# EAGLE design board (EAGLE 8.6.0)
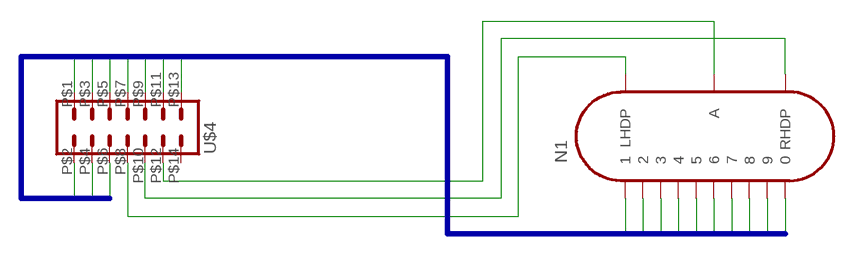
[diagram p0: schematic, sheet 1]

## Parts
N1  IN-14  [IN-14]
U$4  PIN_HEADER_MALE_2X07_14P  [PIN_HEADER_MALE_2X07_14P]

## Nets
N$1: N1.A U$4.P$12
N$2: N1.LHDP U$4.P$8
N$3: N1.RHDP U$4.P$10
NIXIE0: N1.0 U$4.P$1
NIXIE1: N1.1 U$4.P$3
NIXIE2: N1.2 U$4.P$5
NIXIE3: N1.3 U$4.P$7
NIXIE4: N1.4 U$4.P$9
NIXIE5: N1.5 U$4.P$11
NIXIE6: N1.6 U$4.P$13
NIXIE7: N1.7 U$4.P$2
NIXIE8: N1.8 U$4.P$4
NIXIE9: N1.9 U$4.P$6
Unconnected: U$4.P$14

## Buses
NIXIE[0..9]

## Library data of the parts
N1 = russian-nixies:IN-14: IN-14: medium numeric frontview nixie tube
U$4 = 160713 Library by matsu:PIN_HEADER_MALE_2X07_14P

## Net classes
0 default: width 0.508 mm, clearance 0.254 mm

## Board
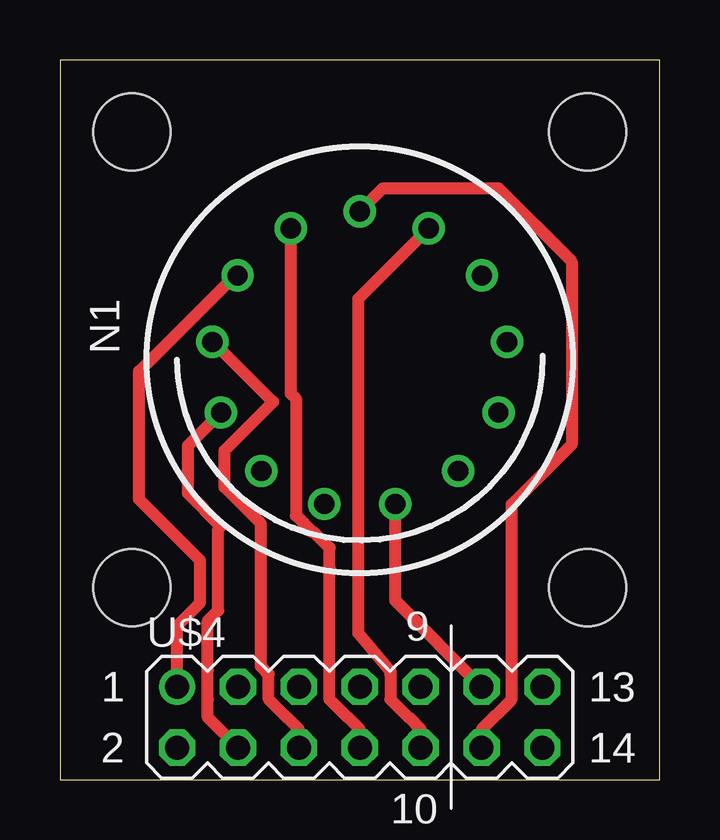
[diagram p1: board, top side]
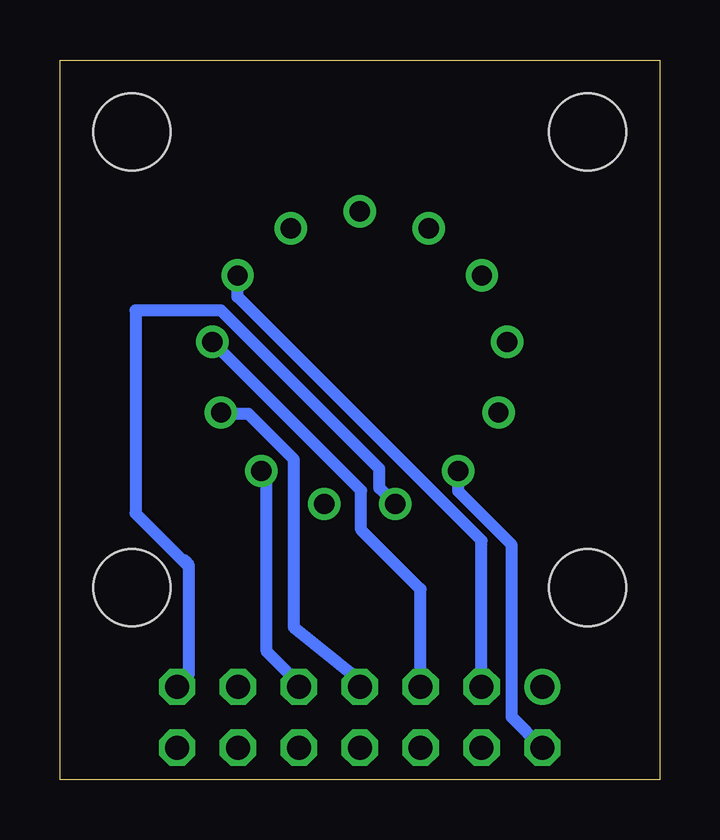
[diagram p2: board, bottom side, seen from below]

Size 25 x 30 mm. Coordinates in mm from the lower left corner, seen from the top.
Outline: 0,0 25,0 25,30 0,30 0,0
Copper layers (1*16): Top 0.035mm / dielectric 1.5mm / Bottom 0.035mm
Design rules "Elecrow_2-layer_eagle_rule": minimum track width 6mil, minimum drill 12mil, track to track 6mil, track to pad 6mil, pad to pad 6mil, via to via 6mil, smd to smd 0mil, copper to edge 10mil, drill to drill 10mil, minimum pad ring 10mil, minimum via ring 6mil, stop-mask expansion 2mil, vias tented up to drill 100mil, thermal gap 10mil
Holes 3.2 mm at 3,27 22,27 22,8 3,8

### Footprints (pad centres in the part's own frame; a part is rotated, then mirrored left to right if it is on the bottom)
IN-14 = drill 0.84: 0 5.094,-3.516; 1 -5.094,-3.516; 2 -6.145,-0.746; 3 -5.788,2.195; 4 -4.105,4.633; 5 -1.481,6.01; 6 1.481,6.01; 7 4.105,4.633; 8 5.788,2.195; 9 6.145,-0.746; A 0,-6.19; LHDP 2.877,-5.481; RHDP -2.877,-5.481
PIN_HEADER_MALE_2X07_14P = drill 1: P$1 -7.62,1.27 | drill 1 octagon: P$2 -7.62,-1.27; P$3 -5.08,1.27; P$4 -5.08,-1.27; P$5 -2.54,1.27; P$6 -2.54,-1.27; P$7 0,1.27; P$8 0,-1.27; P$9 2.54,1.27; P$10 2.54,-1.27; P$11 5.08,1.27; P$12 5.08,-1.27; P$13 7.62,1.27; P$14 7.62,-1.27

### Placement (x,y rotation side)
N1  12.5,17.5 180 top
U$4  12.5,2.6 0 top

### Tracks (layer width: path | path; a pad name or v marks a point on that pad's centre or on a via)
N$1
  Top 0.508: 17.58,2.09 U$4.P$12 17.58,2.08 18.84,3.35 18.84,4.39 18.84,4.4 18.84,11.47 21.34,13.97 21.34,21.59 18.29,24.64 13.45,24.64 N1.A
N$2
  Top 0.508: U$4.P$8 12.5,2.09 11.98,2.61 11.24,3.35 11.24,8.82 11.24,9.66 10.59,10.31 10.53,10.31 9.84,11 9.84,15.88 9.62,16.09 N1.LHDP
N$3
  Top 0.508: U$4.P$10 15.04,2.09 14.52,2.61 13.78,3.35 13.78,4.39 13.78,4.4 13.78,4.51 12.45,6.1 12.45,20.05 N1.RHDP
NIXIE0
  Top 0.508: N1.0 7.24,20.95 3.3,17.02 3.3,11.68 5.84,9.14 5.84,7.37 4.88,6.4 U$4.P$1
NIXIE1
  Bottom 0.508: U$4.P$3 7.42,9.96 17.59,20.13 N1.1
NIXIE2
  Bottom 0.508: U$4.P$5 9.96,7.93 12.45,10.41 12.45,12.05 N1.2
NIXIE3
  Bottom 0.508: N1.3 17.91,15.24 17.14,15.24 15.24,13.34 15.24,6.35 12.57,4.19 U$4.P$7
NIXIE4
  Bottom 0.508: N1.4 16.38,12.57 16.38,5.33 15.24,4.19 U$4.P$9
NIXIE5
  Top 0.508: U$4.P$11 13.98,7.47 N1.5
NIXIE6
  Bottom 0.508: 19.81,9.15 19.64,8.98 19.64,8.89 | 19.64,8.89 19.64,4.35 U$4.P$13 | N1.6 11.68,12.15 11.68,12.96 18.29,19.56 21.84,19.56 21.84,11.1 19.64,8.89
NIXIE7
  Bottom 0.508: N1.7 8.39,12.01 6.16,9.78 6.16,2.61 U$4.P$2
NIXIE8
  Top 0.508: U$4.P$4 6.16,2.59 6.16,3.34 6.16,3.35 6.16,4.57 6.16,6.6 6.6,7.05 6.6,10.45 6.71,10.56 5.33,11.94 5.33,13.93 N1.8
NIXIE9
  Top 0.508: U$4.P$6 9.96,2.09 9.44,2.61 8.7,3.35 8.7,4.39 | 8.7,4.39 | N1.9 6.39,18.25 8.89,15.75 6.86,13.72 6.86,12.19 8.38,10.67 8.38,4.71 8.7,4.39